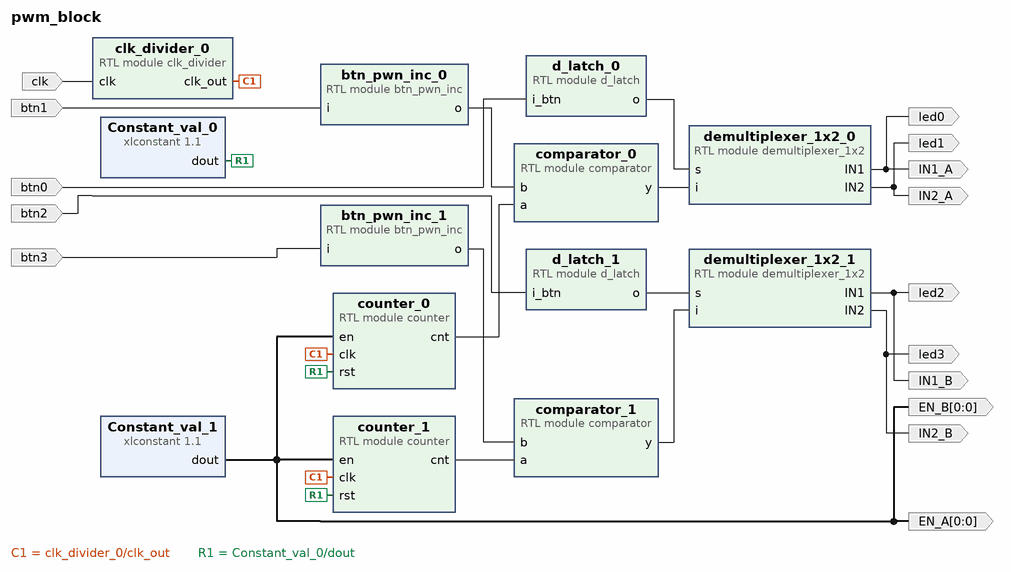
[diagram p0: block diagram of the top level]
# Vivado block design pwm_block, xc7z020clg400-1, Vivado 2023.2.2
create_bd_design pwm_block

create_bd_port -dir I clk
create_bd_port -dir I btn1
create_bd_port -dir I btn0
create_bd_port -dir O IN1_A
create_bd_port -dir O led0
create_bd_port -dir O led1
create_bd_port -dir O IN2_A
create_bd_port -dir O -from 0 -to 0 EN_A
create_bd_port -dir O -from 0 -to 0 EN_B
create_bd_port -dir O led2
create_bd_port -dir O led3
create_bd_port -dir O IN1_B
create_bd_port -dir O IN2_B
create_bd_port -dir I btn3
create_bd_port -dir I btn2

create_bd_cell -type module -reference counter counter_0
create_bd_cell -type module -reference clk_divider clk_divider_0
create_bd_cell -type ip -vlnv xilinx.com:ip:xlconstant:1.1 Constant_val_0
set_property -dict {CONFIG.CONST_VAL 0} [get_bd_cells Constant_val_0]
create_bd_cell -type ip -vlnv xilinx.com:ip:xlconstant:1.1 Constant_val_1
create_bd_cell -type module -reference btn_pwn_inc btn_pwn_inc_0
create_bd_cell -type module -reference comparator comparator_0
create_bd_cell -type module -reference d_latch d_latch_0
create_bd_cell -type module -reference demultiplexer_1x2 demultiplexer_1x2_0
create_bd_cell -type module -reference counter counter_1
create_bd_cell -type module -reference comparator comparator_1
create_bd_cell -type module -reference d_latch d_latch_1
create_bd_cell -type module -reference btn_pwn_inc btn_pwn_inc_1
create_bd_cell -type module -reference demultiplexer_1x2 demultiplexer_1x2_1

# ---- connections ----

connect_bd_net -net btn2_1 [get_bd_ports btn1] [get_bd_pins btn_pwn_inc_0/i]
connect_bd_net -net btn2_2 [get_bd_ports btn2] [get_bd_pins d_latch_1/i_btn]
connect_bd_net -net btn3_1 [get_bd_ports btn3] [get_bd_pins btn_pwn_inc_1/i]
connect_bd_net [get_bd_ports btn0] [get_bd_pins d_latch_0/i_btn]
connect_bd_net [get_bd_pins btn_pwn_inc_0/o] [get_bd_pins comparator_0/b]
connect_bd_net [get_bd_pins btn_pwn_inc_1/o] [get_bd_pins comparator_1/b]
connect_bd_net [get_bd_ports clk] [get_bd_pins clk_divider_0/clk]
connect_bd_net [get_bd_pins clk_divider_0/clk_out] [get_bd_pins counter_0/clk] [get_bd_pins counter_1/clk]
connect_bd_net [get_bd_pins comparator_0/y] [get_bd_pins demultiplexer_1x2_0/i]
connect_bd_net [get_bd_pins comparator_1/y] [get_bd_pins demultiplexer_1x2_1/i]
connect_bd_net [get_bd_pins counter_0/cnt] [get_bd_pins comparator_0/a]
connect_bd_net [get_bd_pins counter_1/cnt] [get_bd_pins comparator_1/a]
connect_bd_net [get_bd_pins d_latch_0/o] [get_bd_pins demultiplexer_1x2_0/s]
connect_bd_net [get_bd_pins d_latch_1/o] [get_bd_pins demultiplexer_1x2_1/s]
connect_bd_net [get_bd_pins demultiplexer_1x2_0/IN1] [get_bd_ports IN1_A] [get_bd_ports led0]
connect_bd_net [get_bd_pins demultiplexer_1x2_0/IN2] [get_bd_ports IN2_A] [get_bd_ports led1]
connect_bd_net [get_bd_pins demultiplexer_1x2_1/IN1] [get_bd_ports led2] [get_bd_ports IN1_B]
connect_bd_net [get_bd_pins demultiplexer_1x2_1/IN2] [get_bd_ports led3] [get_bd_ports IN2_B]
connect_bd_net -net xlconstant_0_dout [get_bd_pins Constant_val_0/dout] [get_bd_pins counter_0/rst] [get_bd_pins counter_1/rst]
connect_bd_net -net xlconstant_0_dout1 [get_bd_pins Constant_val_1/dout] \
  [get_bd_pins counter_0/en] [get_bd_ports EN_A] [get_bd_ports EN_B] [get_bd_pins counter_1/en]

validate_bd_design
save_bd_design
